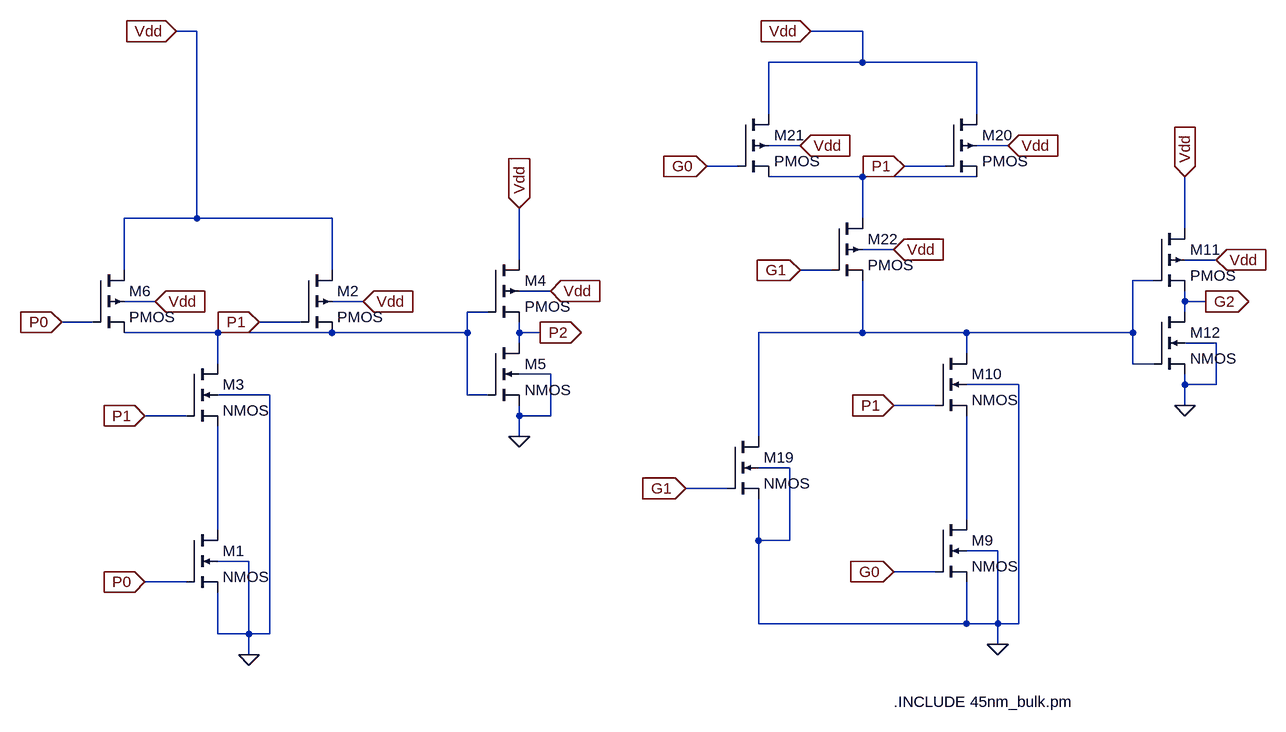
[diagram p0: schematic group_prop_generate_both.asc]
group_prop_generate_both.asc, the LTspice schematic file:
Version 4
SHEET 1 3740 836
WIRE 1968 -448 1936 -448
WIRE 2992 -448 2912 -448
WIRE 2992 -400 2992 -448
WIRE 2992 -400 2848 -400
WIRE 3168 -400 2992 -400
WIRE 2848 -320 2848 -400
WIRE 3168 -320 3168 -400
WIRE 2896 -272 2848 -272
WIRE 3216 -272 3168 -272
WIRE 2800 -240 2752 -240
WIRE 3120 -240 3056 -240
WIRE 2992 -224 2848 -224
WIRE 3168 -224 2992 -224
WIRE 1968 -160 1968 -448
WIRE 1968 -160 1856 -160
WIRE 2176 -160 1968 -160
WIRE 2992 -160 2992 -224
WIRE 3488 -144 3488 -224
WIRE 3040 -112 2992 -112
WIRE 2464 -96 2464 -176
WIRE 3536 -96 3488 -96
WIRE 1856 -80 1856 -160
WIRE 2176 -80 2176 -160
WIRE 2944 -80 2896 -80
WIRE 3440 -64 3408 -64
WIRE 2512 -48 2464 -48
WIRE 1904 -32 1856 -32
WIRE 2224 -32 2176 -32
WIRE 3488 -32 3488 -48
WIRE 3520 -32 3488 -32
WIRE 2416 -16 2384 -16
WIRE 3488 -16 3488 -32
WIRE 1808 0 1760 0
WIRE 2128 0 2064 0
WIRE 2000 16 1856 16
WIRE 2176 16 2000 16
WIRE 2384 16 2384 -16
WIRE 2384 16 2176 16
WIRE 2464 16 2464 0
WIRE 2496 16 2464 16
WIRE 2992 16 2992 -64
WIRE 2992 16 2832 16
WIRE 3152 16 2992 16
WIRE 3408 16 3408 -64
WIRE 3408 16 3152 16
WIRE 2464 32 2464 16
WIRE 3536 32 3488 32
WIRE 3152 48 3152 16
WIRE 2000 64 2000 16
WIRE 3408 64 3408 16
WIRE 3440 64 3408 64
WIRE 2512 80 2464 80
WIRE 3232 96 3152 96
WIRE 3488 96 3488 80
WIRE 3536 96 3536 32
WIRE 3536 96 3488 96
WIRE 2080 112 2000 112
WIRE 2384 112 2384 16
WIRE 2416 112 2384 112
WIRE 3104 128 3040 128
WIRE 3488 128 3488 96
WIRE 1952 144 1888 144
WIRE 2464 144 2464 128
WIRE 2512 144 2512 80
WIRE 2512 144 2464 144
WIRE 2464 176 2464 144
WIRE 2832 176 2832 16
WIRE 2880 224 2832 224
WIRE 2784 256 2720 256
WIRE 3152 304 3152 144
WIRE 2000 320 2000 160
WIRE 2832 336 2832 272
WIRE 2880 336 2880 224
WIRE 2880 336 2832 336
WIRE 3200 352 3152 352
WIRE 2048 368 2000 368
WIRE 3104 384 3040 384
WIRE 1952 400 1888 400
WIRE 2832 464 2832 336
WIRE 3152 464 3152 400
WIRE 3152 464 2832 464
WIRE 3200 464 3200 352
WIRE 3200 464 3152 464
WIRE 3232 464 3232 96
WIRE 3232 464 3200 464
WIRE 2000 480 2000 416
WIRE 2048 480 2048 368
WIRE 2048 480 2000 480
WIRE 2080 480 2080 112
WIRE 2080 480 2048 480
WIRE 3200 496 3200 464
WIRE 2048 512 2048 480
FLAG 3040 384 G0
IOPIN 3040 384 In
FLAG 3040 128 P1
IOPIN 3040 128 In
FLAG 2912 -448 Vdd
IOPIN 2912 -448 In
FLAG 3200 496 0
FLAG 3488 -224 Vdd
IOPIN 3488 -224 In
FLAG 3536 -96 Vdd
IOPIN 3536 -96 In
FLAG 3520 -32 G2
IOPIN 3520 -32 Out
FLAG 3488 128 0
FLAG 2720 256 G1
IOPIN 2720 256 In
FLAG 3216 -272 Vdd
IOPIN 3216 -272 In
FLAG 2752 -240 G0
IOPIN 2752 -240 In
FLAG 2896 -272 Vdd
IOPIN 2896 -272 In
FLAG 2896 -80 G1
IOPIN 2896 -80 In
FLAG 3040 -112 Vdd
IOPIN 3040 -112 In
FLAG 3056 -240 P1
IOPIN 3056 -240 In
FLAG 1888 400 P0
IOPIN 1888 400 In
FLAG 1936 -448 Vdd
IOPIN 1936 -448 In
FLAG 2464 -176 Vdd
IOPIN 2464 -176 In
FLAG 2224 -32 Vdd
IOPIN 2224 -32 In
FLAG 2512 -48 Vdd
IOPIN 2512 -48 In
FLAG 2496 16 P2
IOPIN 2496 16 Out
FLAG 1760 0 P0
IOPIN 1760 0 In
FLAG 1904 -32 Vdd
IOPIN 1904 -32 In
FLAG 2048 512 0
FLAG 2464 176 0
FLAG 2064 0 P1
IOPIN 2064 0 In
FLAG 1888 144 P1
IOPIN 1888 144 In
SYMBOL nmos4 3104 304 R0
SYMATTR InstName M9
SYMATTR Value2 l=45n w=90n
SYMBOL nmos4 3104 48 R0
SYMATTR InstName M10
SYMATTR Value2 l=45n w=90n
SYMBOL pmos4 3440 -144 R0
SYMATTR InstName M11
SYMATTR Value2 l=45n w=90n
SYMBOL nmos4 3440 -16 R0
SYMATTR InstName M12
SYMATTR Value2 l=45n w=45n
SYMBOL nmos4 2784 176 R0
SYMATTR InstName M19
SYMATTR Value2 l=45n w=45n
SYMBOL pmos4 3120 -320 R0
SYMATTR InstName M20
SYMATTR Value2 l=45n w=180n
SYMBOL pmos4 2800 -320 R0
SYMATTR InstName M21
SYMATTR Value2 l=45n w=180n
SYMBOL pmos4 2944 -160 R0
SYMATTR InstName M22
SYMATTR Value2 l=45n w=180n
SYMBOL nmos4 1952 320 R0
SYMATTR InstName M1
SYMATTR Value2 l=45n w=90n
SYMBOL pmos4 2128 -80 R0
SYMATTR InstName M2
SYMATTR Value2 l=45n w=90n
SYMBOL nmos4 1952 64 R0
SYMATTR InstName M3
SYMATTR Value2 l=45n w=90n
SYMBOL pmos4 2416 -96 R0
SYMATTR InstName M4
SYMATTR Value2 l=45n w=90n
SYMBOL nmos4 2416 32 R0
SYMATTR InstName M5
SYMATTR Value2 l=45n w=45n
SYMBOL pmos4 1808 -80 R0
SYMATTR InstName M6
SYMATTR Value2 l=45n w=90n
TEXT 3040 584 Left 2 !.INCLUDE 45nm_bulk.pm

The netlist it stands for:
* group_prop_generate_both.asc
M9 N004 G0 0 0 NMOS l=45n w=90n
M10 N002 P1 N004 0 NMOS l=45n w=90n
M11 Vdd N002 G2 Vdd PMOS l=45n w=90n
M12 G2 N002 0 0 NMOS l=45n w=45n
M19 N002 G1 0 0 NMOS l=45n w=45n
M20 Vdd P1 N001 Vdd PMOS l=45n w=180n
M21 Vdd G0 N001 Vdd PMOS l=45n w=180n
M22 N001 G1 N002 Vdd PMOS l=45n w=180n
M1 N005 P0 0 0 NMOS l=45n w=90n
M2 Vdd P1 N003 Vdd PMOS l=45n w=90n
M3 N003 P1 N005 0 NMOS l=45n w=90n
M4 Vdd N003 P2 Vdd PMOS l=45n w=90n
M5 P2 N003 0 0 NMOS l=45n w=45n
M6 Vdd P0 N003 Vdd PMOS l=45n w=90n
.model NMOS NMOS
.model PMOS PMOS
.lib standard.mos
.INCLUDE 45nm_bulk.pm
.backanno
.end